# Altium schematic sheet RaspberryPI4.SchDoc
size Tabloid; SheetNumber: 4; SheetTotal: 7
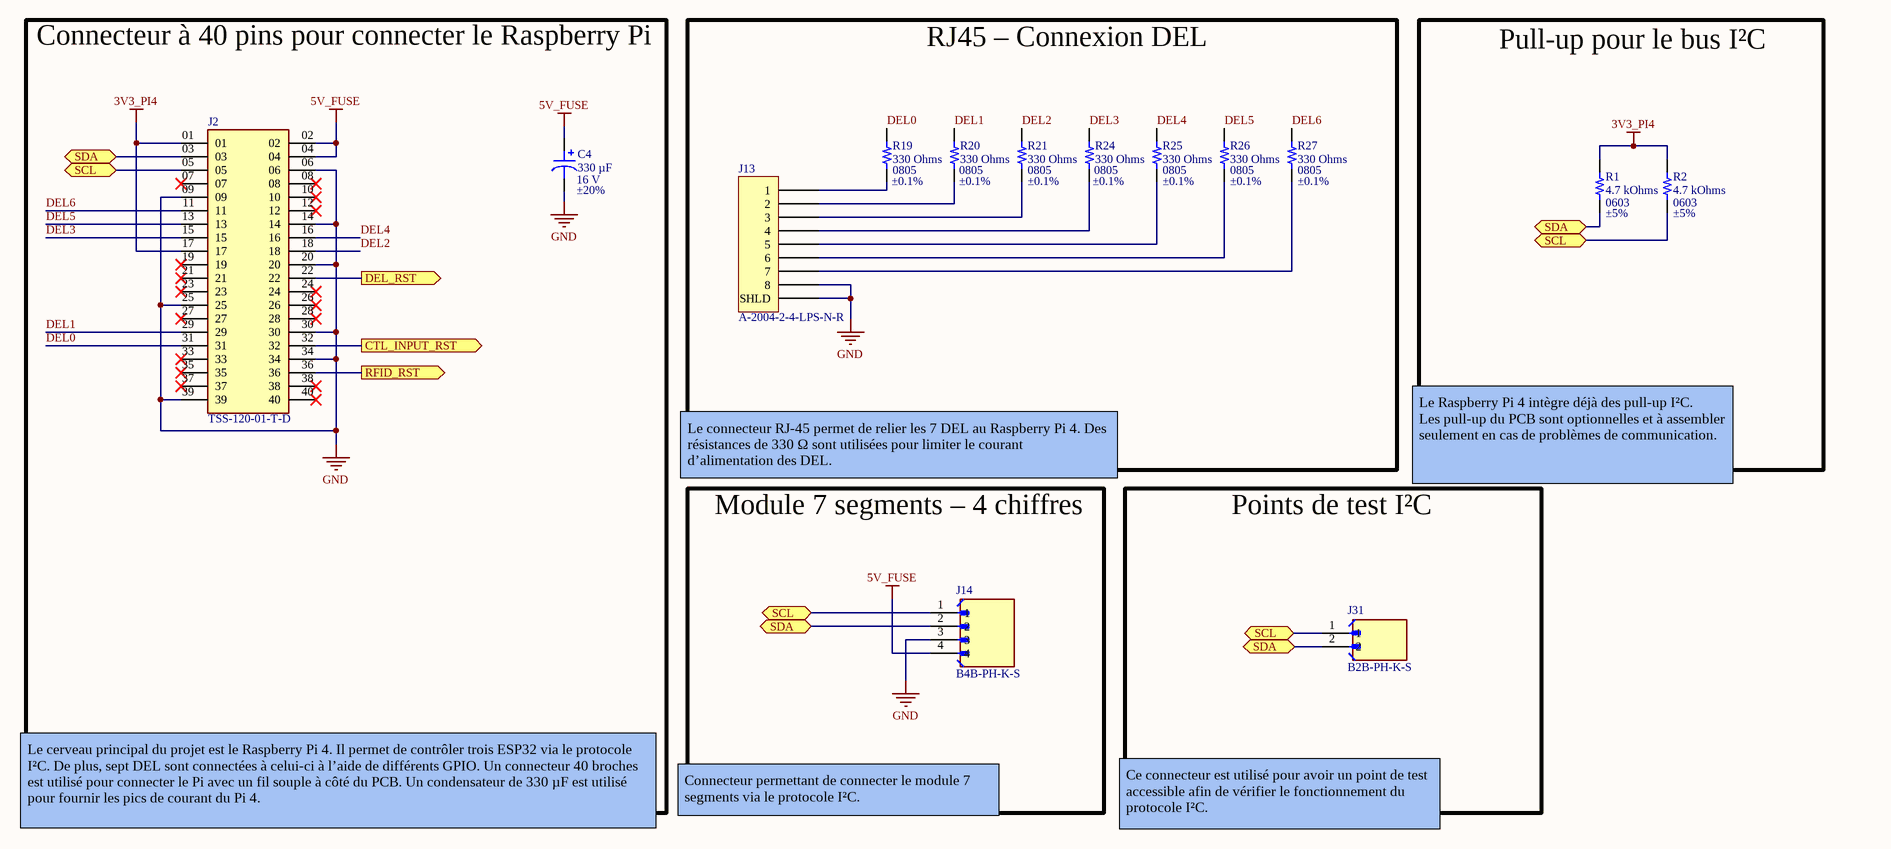
[diagram p0: RaspberryPI4.SchDoc]

## Parts
C4  330 µF  Tolerance: ±20%  Voltage - Rated: 16 V  [CAP ALSMD 8.3MM H10.5MM]
J2  TSS-120-01-T-D  [SAMTEC_TSS-120-01-T-D]
J13  A-2004-2-4-LPS-N-R  [ASSMANN A-2004-2-4-LPS-N-R]
J14  B4B-PH-K-S  [JST_B4B-PH-K-S]
J31  B2B-PH-K-S  [JST_B2B-PH-K-S]
R1  Supplier Device Package: 0603  Tolerance: ±5%  [RES 0603_1608]  (hidden comment: 4.7 kOhms)
R2  Supplier Device Package: 0603  Tolerance: ±5%  [RES 0603_1608]  (hidden comment: 4.7 kOhms)
R19  Supplier Device Package: 0805  Tolerance: ±0.1%  [RES 0805_2012]  (hidden comment: 330 Ohms)
R20  Supplier Device Package: 0805  Tolerance: ±0.1%  [RES 0805_2012]  (hidden comment: 330 Ohms)
R21  Supplier Device Package: 0805  Tolerance: ±0.1%  [RES 0805_2012]  (hidden comment: 330 Ohms)
R24  Supplier Device Package: 0805  Tolerance: ±0.1%  [RES 0805_2012]  (hidden comment: 330 Ohms)
R25  Supplier Device Package: 0805  Tolerance: ±0.1%  [RES 0805_2012]  (hidden comment: 330 Ohms)
R26  Supplier Device Package: 0805  Tolerance: ±0.1%  [RES 0805_2012]  (hidden comment: 330 Ohms)
R27  Supplier Device Package: 0805  Tolerance: ±0.1%  [RES 0805_2012]  (hidden comment: 330 Ohms)

## Blocks framed on the sheet
Connecteur à 40 pins pour connecter le Raspberry Pi: C4 J2
RJ45 – Connexion DEL: J13 R19-R21 R24-R27
Pull-up pour le bus I²C: R1 R2
Module 7 segments – 4 chiffres: J14
Points de test I²C: J31

## Ports
CTL_INPUT_RST (out), DEL_RST (out), RFID_RST (out), SCL (bidir), SDA (bidir)

## Nets
3V3_PI4: J2.01 J2.17 R1.2 R2.2
5V_FUSE: C4.1 J2.02 J2.04 J14.4
GND: C4.2 J2.06 J2.09 J2.14 J2.20 J2.25 J2.30 J2.34 J2.39 J13.8 J13.S(SHLD) J14.3
CTL_INPUT_RST: J2.32 ; port CTL_INPUT_RST
DEL0: J2.31 R19.2
DEL1: J2.29 R20.2
DEL2: J2.18 R21.2
DEL3: J2.15 R24.2
DEL4: J2.16 R25.2
DEL5: J2.13 R26.2
DEL6: J2.11 R27.2
DEL_RST: J2.22 ; port DEL_RST
RFID_RST: J2.36 ; port RFID_RST
SCL: J2.05 J14.1 J31.1 R2.1 ; port SCL
SDA: J2.03 J14.2 J31.2 R1.1 ; port SDA
NetJ13_1: J13.1 R19.1
NetJ13_2: J13.2 R20.1
NetJ13_3: J13.3 R21.1
NetJ13_4: J13.4 R24.1
NetJ13_5: J13.5 R25.1
NetJ13_6: J13.6 R26.1
NetJ13_7: J13.7 R27.1

Not connected (* = marked no-connect by the designer): J2 07* 08* 10* 12* 19* 21* 23* 24* 26* 27* 28* 33* 35* 37* 38* 40*

## Notes on the sheet
- Le connecteur RJ-45 permet de relier les 7 DEL au Raspberry Pi 4. Des résistances de 330 Ω sont utilisées pour limiter le courant d’alimentation des DEL.
- Le Raspberry Pi 4 intègre déjà des pull-up I²C.
  Les pull-up du PCB sont optionnelles et à assembler seulement en cas de problèmes de communication.
- Le cerveau principal du projet est le Raspberry Pi 4. Il permet de contrôler trois ESP32 via le protocole I²C. De plus, sept DEL sont connectées à celui-ci à l’aide de différents GPIO. Un connecteur 40 broches est utilisé pour connecter le Pi avec un fil souple à côté du PCB. Un condensateur de 330 µF est utilisé pour fournir les pics de courant du Pi 4.
- Connecteur permettant de connecter le module 7 segments via le protocole I²C.
- Ce connecteur est utilisé pour avoir un point de test accessible afin de vérifier le fonctionnement du protocole I²C.
- Nom de la feuille
- Titre du projet
- Cours associé au projet
- Taille
- Département
- Technologies du
- Révision
- PCB
- .
- SCH
- Date
- génie électrique
- Feuille
- Variant
- de
- Concepteurs

## Library data of the parts
C4 = 865060353008: CAP ALUM 330UF 20% 16V SMD; manufacturer: Würth Elektronik; Impedance: 170 mOhms; Lifetime @ Temp.: 5000 Hrs @ 105°C; Polarization: Polar; Ripple Current @ High Frequency: 550 mA @ 100 kHz; Ripple Current @ Low Frequency: 357.5 mA @ 120 Hz; Surface Mount Land Size: 0.327" L x 0.327" W (8.30mm x 8.30mm); Part Number: 865060353008; Applications: General Purpose; Capacitance: 330 µF; componentlink1description: Datasheet; componentlink1url: https://katalog.we-online.de/pbs/datasheet/865060353008.pdf; componentlink2description: DigiKey Link; componentlink2url: https://www.digikey.com/en/products/detail/würth-elektronik/865060353008/5728120; Device Package: Radial, Can - SMD; Height - Seated (Max): 0.413" (10.50mm); lastupdated: 2024-06-03 8:15:49 PM; Lifecycle Status: Active; Minimum Order: 1; Mounting Type: Surface Mount; Operating Temperature: -55°C ~ 105°C; Package / Case: Radial, Can - SMD; packaging: TapeAndReel; partid: 7463; Part Status: Active; price: 0.39; series: WCAP-ASLL; Size / Dimension: 0.315" Dia (8.00mm); Supplier 1: DigiKey; Supplier Part Number 1: 732-8525-1-ND; value: 330 µF
J2 = TSS-120-01-T-D: Connector Header Through Hole 40 position 0.100 (2.54mm); MF: Samtec; Check_prices: https://www.snapeda.com/parts/TSS-120-01-T-D/Samtec/view-part/?ref=eda; Availability: In Stock; Price: None; Package: None; Value: *; Purchase-URL: https://pricing.snapeda.com/search/part/TSS-120-01-T-D/?ref=eda; SnapEDA_Link: https://www.snapeda.com/parts/TSS-120-01-T-D/Samtec/view-part/?ref=snap; MP: TSS-120-01-T-D
J13 = A-2004-2-4-LPS-N-R: CONN MOD JACK 8P8C R/A SHIELDED; Manufacturer: Assmann WSW Components; LED Color: Does Not Contain LED; Number of Ports: 1; Number of Positions/Contacts: 8p8c (RJ45, Ethernet); Tab Direction: Down; Part Number: A-2004-2-4-LPS-N-R; ComponentLink1Description: Datasheet; ComponentLink1URL: http://www.assmann-wsw.com/fileadmin/datasheets/ASS_7323_CO.pdf; ComponentLink2Description: DigiKey Link; ComponentLink2URL: http://digikey.com/product-detail/en/assmann-wsw-components/A-2004-2-4-LPS-N-R/AE10387-ND/2183638; Connector Type: Jack; Contact Finish: Gold; Contact Material: Phosphor Bronze; Features: Board Lock; LastUpdated: 2020-01-15 3:54:20 AM; Lifecycle Status: Active; Minimum Order: 1; Mounting Type: Through Hole; Number of Rows: 1; Orientation: 90° Angle (Right); Packaging: Tray; Part Status: Active; Price: 1.05; Series: -; Shielding: Shielded; Supplier 1: DigiKey; Supplier Part Number 1: AE10387-ND; Termination: Solder
J14 = B4B-PH-K-S: MF: {'manufacturer': u'JST Sales America Inc.'}; Package: None; Price: None; Value: *; MP: B4B-PH-K-S; Availability: Unavailable
J31 = B2B-PH-K-S: Connector Header Through Hole 2 position 0.079 (2.00mm); MF: JST Sales America Inc.; SnapEDA_Link: https://www.snapeda.com/parts/B2B-PH-K-S/JST/view-part/?ref=snap; Package: None; Value: *; MP: B2B-PH-K-S; Check_prices: https://www.snapeda.com/parts/B2B-PH-K-S/JST/view-part/?ref=eda
R1 R2 = ESR03EZPJ472: RES SMD 4.7K OHM 5% 1/4W 0603; Manufacturer: Rohm Semiconductor; Power (Watts): 0.25W, 1/4W; Temperature Coefficient: ±200ppm/°C; Part Number: ESR03EZPJ472; Value: 4.7 kOhms; ComponentLink1Description: Datasheet; ComponentLink1URL: https://www.rohm.com/datasheet/ESR01MZPF/esr-e; ComponentLink2Description: DigiKey Link; ComponentLink2URL: https://www.digikey.com/en/products/detail/rohm-semiconductor/ESR03EZPJ472/1762733; Composition: Thick Film; Device Package: 0603 (1608 Metric); Features: Automotive AEC-Q200, Pulse Withstanding; Height - Seated (Max): 0.022" (0.55mm); LastUpdated: 2024-02-09 8:43:15 PM; Lifecycle Status: Active; Minimum Order: 1; Number of Terminations: 2; Operating Temperature: -55°C ~ 155°C; Package / Case: 0603 (1608 Metric); Packaging: TapeAndReel; PartId: 10235; Part Status: Active; Price: 0.01; Ratings: AEC-Q200; Resistance: 4.7 kOhms; Series: ESR; Size / Dimension: 0.063" L x 0.031" W (1.60mm x 0.80mm); Supplier 1: DigiKey; Supplier Part Number 1: RHM4.7KDCT-ND
R19-R21 R24-R27 = ERJ-PB6B3300V: RES SMD 330 OHM 0.1% 1/4W 0805; Manufacturer: Panasonic Electronic Components; Power (Watts): 0.25W, 1/4W; Temperature Coefficient: ±50ppm/°C; Part Number: ERJ-PB6B3300V; Value: 330 Ohms; ComponentLink1Description: Datasheet; ComponentLink1URL: https://industrial.panasonic.com/cdbs/www-data/pdf/RDM0000/AOA0000C328.pdf; ComponentLink2Description: DigiKey Link; ComponentLink2URL: https://www.digikey.com/en/products/detail/panasonic-electronic-components/ERJ-PB6B3300V/6213320; Composition: Thick Film; Device Package: 0805 (2012 Metric); Features: Automotive AEC-Q200, Pulse Withstanding; Height - Seated (Max): 0.028" (0.70mm); LastUpdated: 2024-02-08 9:02:05 PM; Lifecycle Status: Active; Minimum Order: 1; Number of Terminations: 2; Operating Temperature: -55°C ~ 155°C; Package / Case: 0805 (2012 Metric); Packaging: TapeAndReel; PartId: 35583; Part Status: Active; Price: 0.04; Ratings: AEC-Q200; Resistance: 330 Ohms; Series: ERJ-PB6; Size / Dimension: 0.079" L x 0.049" W (2.00mm x 1.25mm); Supplier 1: DigiKey; Supplier Part Number 1: P20537CT-ND